# Altium schematic sheet wifi_radio.SchDoc: Epiphany - Radio #1
size Legal; CompanyName: Brinton Engineering, LLC; DrawnBy: J. Brinton; Engineer: J. Brinton; Address1: 3479 Edison Way; Address2: Menlo Park CA 94025; Address3: +1 (877) 778-8435; Address4: brintonengineering.com; Revision: 1; SheetNumber: 4; SheetTotal: 19; PageSetup: Record=PageOptions|CenterHorizontal=True|CenterVertical=True|PrintScale=0.99|XCorrection=1.00|YCorrection=1.00|PrintKind=1|BorderSize=5000000|LeftOffset=0|BottomOffset=0|Orientation=2|PaperLength=1000|PaperWidth=1000|Scale=100|PaperSource=15|PrintQuality=600|MediaType=1|DitherType=10|PaperKind=Legal|PrintScaleMode=1
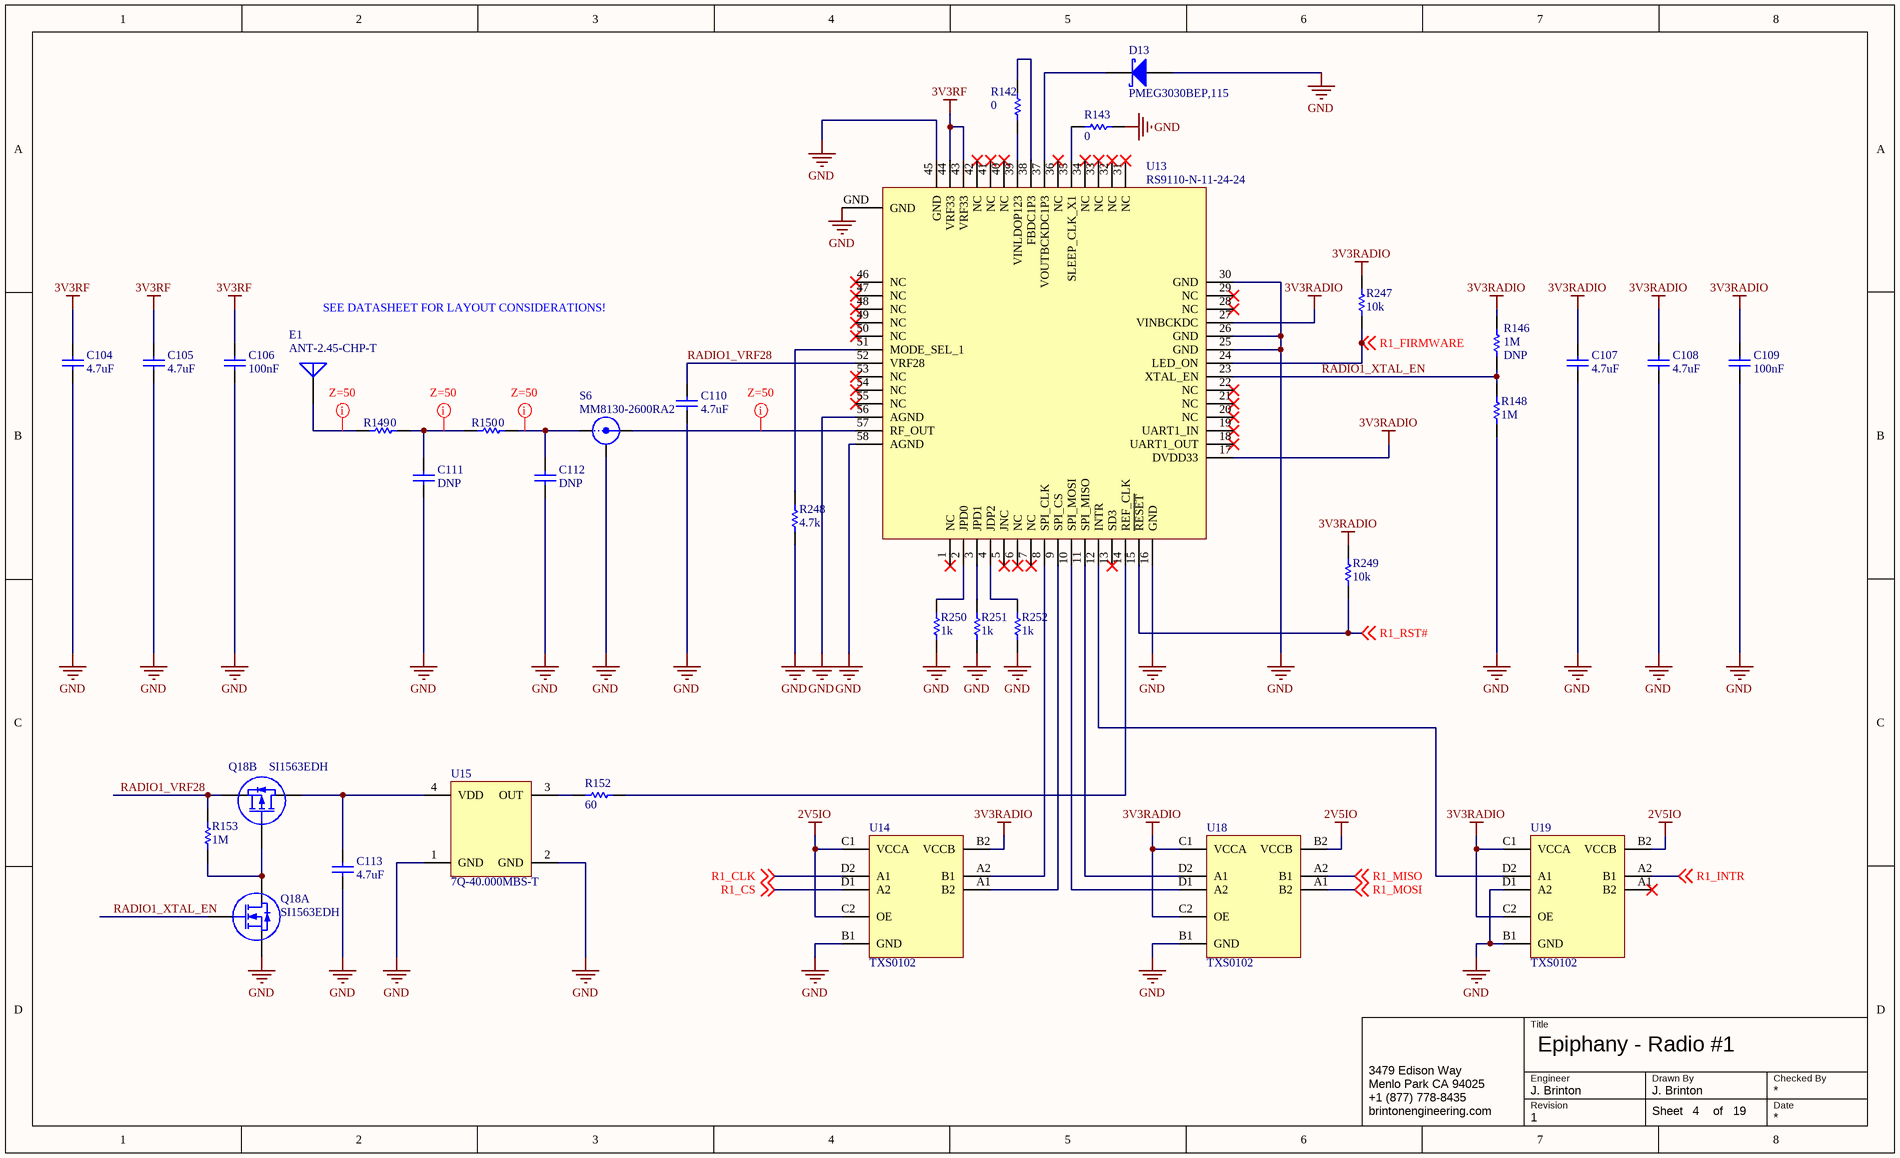
[diagram p0: wifi_radio.SchDoc]

## Parts
C104  value 4.7uF  [0603]  (hidden comment: CAP 0603 4.7UF 6.3V)
C105  value 4.7uF  [0603]  (hidden comment: CAP 0603 4.7UF 6.3V)
C106  value 100nF  [0402]  (hidden comment: CAP 0402 100NF 16V)
C107  value 4.7uF  [0603]  (hidden comment: CAP 0603 4.7UF 6.3V)
C108  value 4.7uF  [0603]  (hidden comment: CAP 0603 4.7UF 6.3V)
C109  value 100nF  [0402]  (hidden comment: CAP 0402 100NF 16V)
C110  value 4.7uF  [0603]  (hidden comment: CAP 0603 4.7UF 6.3V)
C111  Do Not Place: DNP  [0201]  (hidden comment: CAP)
C112  Do Not Place: DNP  [0201]  (hidden comment: CAP)
C113  value 4.7uF  [0603]  (hidden comment: CAP 0603 4.7UF 6.3V)
D13  PMEG3030BEP,115  [PMEG3030BEP,115]
E1  ANT-2.45-CHP-T  [ANT-2.45-CHP-T]
Q18  SI1563EDH  [SI1563EDH]  (parts A,B of 2)
R142  value 0  [0603]  (hidden comment: RES 0603 0 1A)
R143  value 0  [0603]  (hidden comment: RES 0603 0 1A)
R146  value 1M  Do Not Place: DNP  [0603]  (hidden comment: RES 0603 1M 1%)
R148  value 1M  [0603]  (hidden comment: RES 0603 1M 1%)
R149  value 0  [0603]  (hidden comment: RES 0603 0 1A)
R150  value 0  [0603]  (hidden comment: RES 0603 0 1A)
R152  value 60  [0603]  (hidden comment: RES 0603 0 1A)
R153  value 1M  [0603]  (hidden comment: RES 0603 1M 1%)
R247  value 10k  [0603]  (hidden comment: RES 0603 10k 1%)
R248  value 4.7k  [0603]  (hidden comment: RES 0603 4.7k 1%)
R249  value 10k  [0603]  (hidden comment: RES 0603 10k 1%)
R250  value 1k  [0603]  (hidden comment: RES 0603 1k 1%)
R251  value 1k  [0603]  (hidden comment: RES 0603 1k 1%)
R252  value 1k  [0603]  (hidden comment: RES 0603 1k 1%)
S6  MM8130-2600RA2  [MM8130-2600RA2]
U13  RS9110-N-11-24-24  [RS9110-N-11-24-24]
U14  TXS0102  [TXS0102YZPR]
U15  7Q-40.000MBS-T  [7Q-40.000MBS-T]
U18  TXS0102  [TXS0102YZPR]
U19  TXS0102  [TXS0102YZPR]

## Nets
2V5IO: U14.C1(VCCA) U14.C2(OE) U18.B2(VCCB) U19.B2(VCCB)
3V3RADIO: C107.2 C108.2 C109.2 R146.1 R247.2 R249.2 U13.17(DVDD33) U13.27(VINBCKDC) U14.B2(VCCB) U18.C1(VCCA) U18.C2(OE) U19.C1(VCCA) U19.C2(OE)
3V3RF: C104.2 C105.2 C106.2 U13.43(VRF33) U13.44(VRF33)
GND: C104.1 C105.1 C106.1 C107.1 C108.1 C109.1 C110.1 C111.1 C112.1 C113.1 D13.1(A) Q18.1(S) R143.1 R148.2 R248.2 R250.2 R251.2 R252.2 S6.2(GND) U13.16(GND) U13.25(GND) U13.26(GND) U13.30(GND) U13.45(GND) U13.56(AGND) U13.58(AGND) U13.GND U14.B1(GND) U15.1(GND) U15.2(GND) U18.B1(GND) U19.B1(GND) U19.D1(A2)
R1_CLK: U14.D2(A1) ; off-sheet R1_CLK
R1_CS: U14.D1(A2) ; off-sheet R1_CS
R1_FIRMWARE: R247.1 U13.24(LED_ON) ; off-sheet R1_FIRMWARE
R1_INTR: U19.A2(B1) ; off-sheet R1_INTR
R1_MISO: U18.A2(B1) ; off-sheet R1_MISO
R1_MOSI: U18.A1(B2) ; off-sheet R1_MOSI
R1_RST#: R249.1 U13.15(~{RESET}) ; off-sheet R1_RST#
RADIO1_VRF28: C110.2 Q18.4(S) R153.1 U13.52(VRF28)
RADIO1_XTAL_EN: Q18.2(G) R146.2 R148.1 U13.23(XTAL_EN)
NetC111_2: C111.2 R149.2 R150.1
NetC112_2: C112.2 R150.2 S6.3(OUT)
NetC113_2: C113.2 Q18.3(D) U15.4(VDD)
NetD13_2: D13.2(K) U13.37(VOUTBCKDC1P3)
NetE1_1: E1.1(A) R149.1
NetQ18_5: Q18.5(G) Q18.6(D) R153.2
NetR142_1: R142.1 U13.39(VINLDOP123)
NetR142_2: R142.2 U13.38(FBDC1P3)
NetR143_2: R143.2 U13.35(SLEEP_CLK_X1)
NetR152_1: R152.1 U13.14(REF_CLK)
NetR152_2: R152.2 U15.3(OUT)
NetR248_1: R248.1 U13.51(MODE_SEL_1)
NetR250_1: R250.1 U13.2(JPD0)
NetR251_1: R251.1 U13.3(JPD1)
NetR252_1: R252.1 U13.4(JDP2)
NetS6_1: S6.1(IN) U13.57(RF_OUT)
NetU13_8: U13.8(SPI_CLK) U14.A2(B1)
NetU13_9: U13.9(SPI_CS) U14.A1(B2)
NetU13_10: U13.10(SPI_MOSI) U18.D1(A2)
NetU13_11: U13.11(SPI_MISO) U18.D2(A1)
NetU13_12: U13.12(INTR) U19.D2(A1)

Not connected (* = marked no-connect by the designer): U13 1(NC)* 5(JNC)* 6(NC)* 7(NC)* 13(SD3)* 18(UART1_OUT)* 19(UART1_IN)* 20(NC)* 21(NC)* 22(NC)* 28(NC)* 29(NC)* 31(NC)* 32(NC)* 33(NC)* 34(NC)* 36(NC)* 40(NC)* 41(NC)* 42(NC)* 46(NC)* 47(NC)* 48(NC)* 49(NC)* 50(NC)* 53(NC)* 54(NC)* 55(NC)*; U19 A1(B2)*

## Layout directives
rule Impedance Constraint [Min = 49.50    Max = 50.50    ]: NetC111_2, NetC112_2, NetE1_1, NetS6_1

## Notes on the sheet
- SEE DATASHEET FOR LAYOUT CONSIDERATIONS!
- Title
- Engineer
- Revision
- Drawn By
- Checked By
- Date
- Sheet
- of

## Library data of the parts
C104 C105 C107 C108 C110 C113 = CAP: Ceramic Capacitor 4.7uF +/-10% 6.3V SMD 0603; Manufacturer: Kemet; Manufacturer P/N: C0603C475K9PACTU; Tr: [-55:85]; Tolerance: +/-10%; Voltage: 6.3V
C106 C109 = CAP: Ceramic Capacitor 100nF +/-10% 16V X7R SMD 0402; Manufacturer: Taiyo Yuden; Manufacturer P/N: EMK105B7104KV-F; Tr: [-55:125]; Tolerance: +/-10%; Voltage: 16V; Scale: Scale
C111 C112 = CAP: Ceramic Capacitor; Manufacturer: *; Manufacturer P/N: *; Tolerance: *; Voltage: *; Tr: *; Value: *
D13 = SCHOTTKY: Schottky Diode 40V, 3A, SMD SOD-128; Manufacturer: NXP Semiconductor; Vr(max): 40v; Manufacturer P/N: PMEG3030BEP,115
E1 = ANT-2.45-CHP-T: Dielectric Chip Antenna 2.45GHz; Manufacturer: Linx Technologies; Manufacturer P/N: ANT-2.45-CHP-T
Q18 = SI1563EDH: Complementary Pair Enhancement Mode MOSFET; Manufacturer: Vishay; Manufacturer P/N: SI1563EDH
R142 R143 R149 R150 = RES 0603 0 1A: Thick Film Chip Resistor 0 Ohms 1A SMD 0603; Manufacturer: Panasonic - ECG; Manufacturer P/N: ERJ3GE0R00V; Tr: -55:+70; Tcr: *; Tolerance: *; Alternatives: *; Voltage: *; Power: *; P/N: ERJ3GE0R00V
  R142: Proto: Proto
  R143 R149 R150: Scale: Scale
R146 R148 R153 = RES 0603 1M 1%: Thick Film Resistor 1M Ohms +/-1% 0.1W 75V SMD 0603; Manufacturer: Panasonic - ECG; Manufacturer P/N: ERJ3EKF1004V; Tcr: +/-100; Tr: -55:+155; Tolerance: +/-1%; Alternatives: *; Voltage: 75V; Power: 0.1W; P/N: ERJ3EKF1004V; Scale: Scale
R152 = RES 0603 0 1A: Thick Film Chip Resistor 0 Ohms 1A SMD 0603; Manufacturer: Panasonic - ECG; Manufacturer P/N: ERJ3GE0R00V; Tr: -55:+70; Notes: Change value in production; Tcr: *; Tolerance: *; Alternatives: *; Voltage: *; Power: *; P/N: ERJ3GE0R00V; Scale: Scale
R247 R249 = RES 0603 10k 1%: Thick Film Resistor 10k Ohms +/-1% 0.1W 75V SMD 0603; Manufacturer: Panasonic - ECG; Manufacturer P/N: ERJ3EKF1002V; Tcr: +/-100; Tr: -55:+155; Tolerance: +/-1%; Alternatives: *; Voltage: 75V; Power: 0.1W; P/N: ERJ3EKF1002V; Scale: Scale
R248 = RES 0603 47.5k 1%: Thick Film Resistor 4.7k Ohms +/-1% 0.1W 75V SMD 0603; Manufacturer: Panasonic - ECG; Manufacturer P/N: ERJ3EKF4701V; Tcr: +/-100; Tr: -55:+155; Tolerance: +/-1%; Alternatives: *; Voltage: 75V; Power: 0.1W; P/N: ERJ3EKF4701V; Scale: Scale
R250-R252 = RES 0603 1k 1%: Thick Film Resistor 1k Ohms +/-1% 0.1W 75V SMD 0603; Manufacturer: Panasonic - ECG; Manufacturer P/N: ERJ3EKF1001V; Tcr: +/-100; Tr: -55:+155; Tolerance: +/-1%; Alternatives: *; Voltage: 75V; Power: 0.1W; P/N: ERJ3EKF1001V; Scale: Scale
S6 = MM8130-2600RA2: Microwave Switch Connector; Manufacturer: Murata; Manufacturer P/N: MM8130-2600RA2
U13 = RS9110-N-11-24: 802.11bgn WLAN Module; Manufacturer: Redpine Signals; Manufacturer P/N: RS9110-N-11-24-24
U14 U18 U19 = TXS0102: Dual Bidirectional Digital Level Translator; Manufacturer: Texas Instruments; Manufacturer P/N: TXS0102
U15 = 7Q-40.000MBS-T: 40MHz Crystal Clock Oscillator; Manufacturer: TXC; Manufacturer P/N: 7Q-40.000MBS-T